# EAGLE design esquematico (EAGLE 8.1.0)
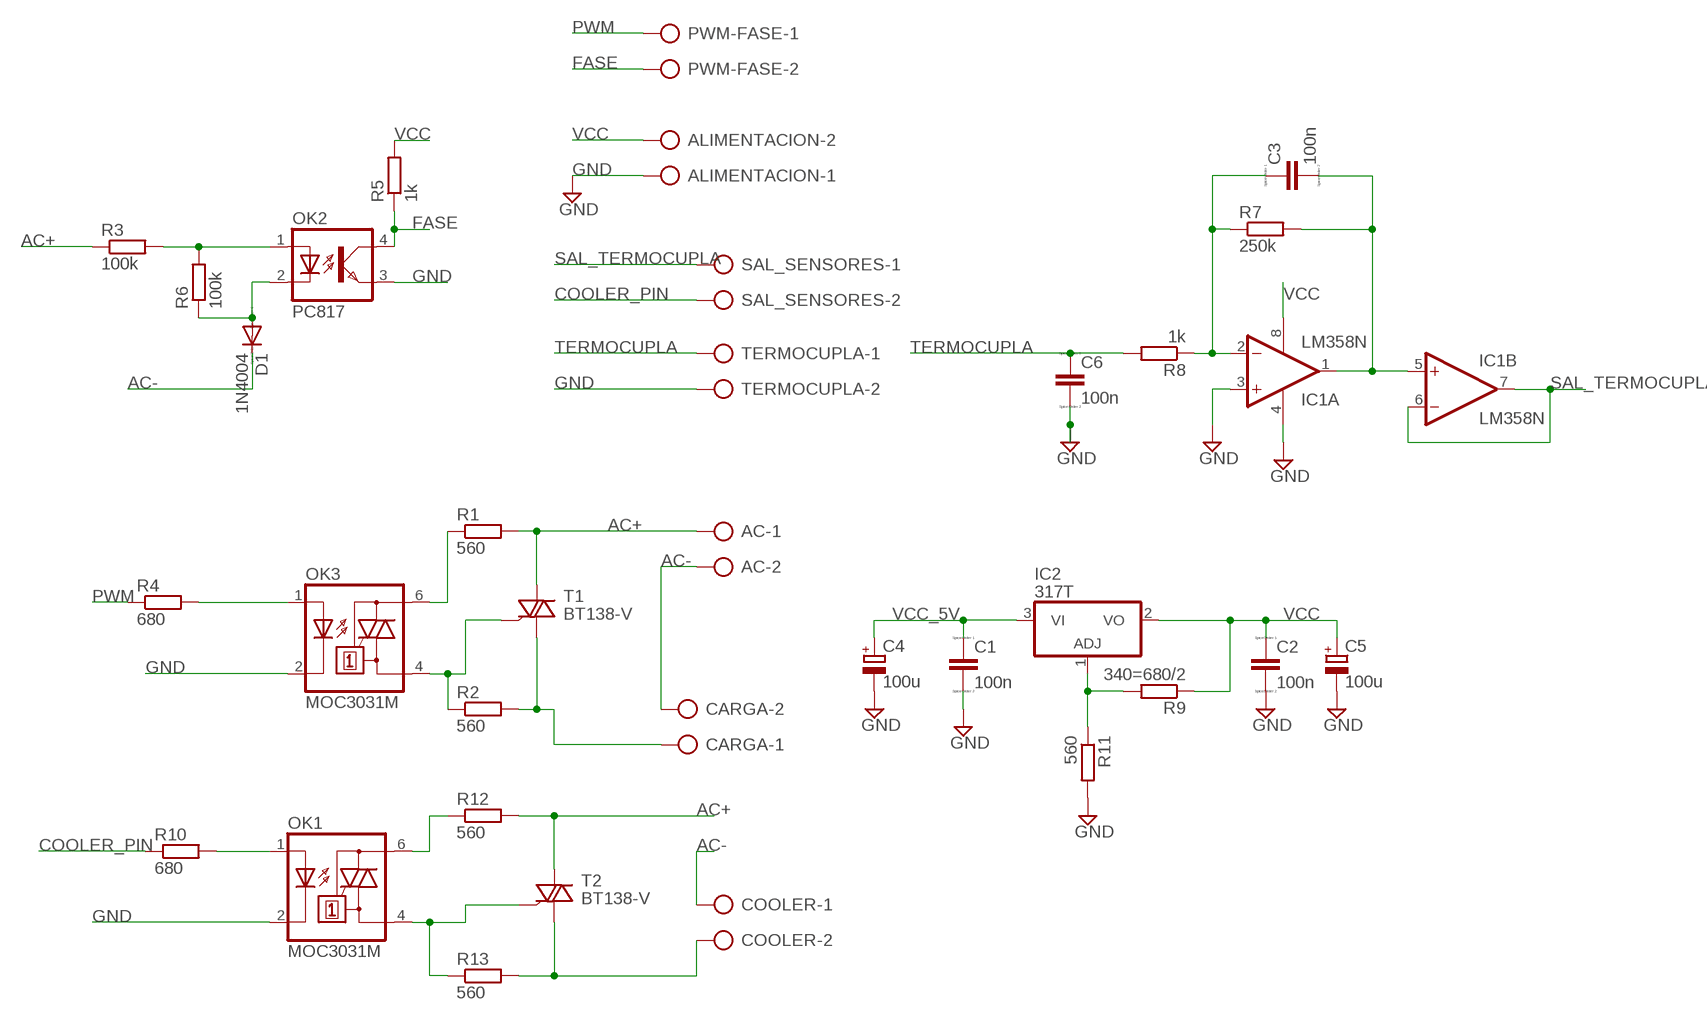
[diagram p0: schematic, sheet 1]

## Parts
AC  AK300/2  [AK300/2]
ALIMENTACION  AK300/2  [AK300/2]
C1  100n  CC1206  [C1206]
C2  100n  CC1206  [C1206]
C3  100n  CC1206  [C1206]
C4  100u  CPOL-EUE1.8-4  [E1,8-4]
C5  100u  CPOL-EUE1.8-4  [E1,8-4]
C6  100n  CC1206  [C1206]
CARGA  AK300/2  [AK300/2]
COOLER  AK300/2  [AK300/2]
D1  1N4004  [DO41-10]
IC1  LM358N  [DIL08]
IC2  317T  [TO220H]
OK1  MOC3031M  [DIL06]
OK2  PC817  [DIL04]
OK3  MOC3031M  [DIL06]
PWM-FASE  AK300/2  [AK300/2]
R1  560  R-EU_R1206  [R1206]
R2  560  R-EU_R1206  [R1206]
R3  100k  R-EU_0207/10  [0207/10]
R4  680  R-EU_R1206  [R1206]
R5  1k  R-EU_R1206  [R1206]
R6  100k  R-EU_R1206  [R1206]
R7  250k  R-EU_R1206  [R1206]
R8  1k  R-EU_R1206  [R1206]
R9  340=680/2  R-EU_R1206  [R1206]
R10  680  R-EU_R1206  [R1206]
R11  560  R-EU_R1206  [R1206]
R12  560  R-EU_R1206  [R1206]
R13  560  R-EU_R1206  [R1206]
SAL_SENSORES  AK300/2  [AK300/2]
T1  BT138-V  [TO220BV]
T2  BT138-V  [TO220BV]
TERMOCUPLA  AK300/2  [AK300/2]

## Nets
AC+: AC.1 R1.2 R3.1 R12.2 T1.T2(A2) T2.T2(A2)
AC-: AC.2 CARGA.2 COOLER.1 D1.C
COOLER_PIN: R10.1 SAL_SENSORES.2
FASE: OK2.4(COL) PWM-FASE.2 R5.1
GND: ALIMENTACION.1 C1.2 C2.2 C4.- C5.- C6.2 IC1.3(A:+IN) IC1.4(P:V-) OK1.2(C) OK2.3(EMIT) OK3.2(C) R11.2 TERMOCUPLA.2
N$1: OK3.1(A) R4.2
N$2: OK3.6(A2) R1.1
N$3: OK2.1(A) R3.2 R6.2
N$4: CARGA.1 R2.2 T1.T1(A1)
N$5: C3.1 IC1.2(A:-IN) R7.1 R8.1
N$6: IC2.1(ADJ) R9.2 R11.1
N$7: C3.2 IC1.1(A:OUT) IC1.5(B:+IN) R7.2
N$8: OK3.4(A1) R2.1 T1.G
N$9: D1.A OK2.2(C) R6.1
N$11: OK1.1(A) R10.2
N$12: OK1.6(A2) R12.1
N$15: OK1.4(A1) R13.1 T2.G
N$17: COOLER.2 R13.2 T2.T1(A1)
PWM: PWM-FASE.1 R4.1
SAL_TERMOCUPLA: IC1.6(B:-IN) IC1.7(B:OUT) SAL_SENSORES.1
TERMOCUPLA: C6.1 R8.2 TERMOCUPLA.1
VCC: ALIMENTACION.2 C2.1 C5.+ IC1.8(P:V+) IC2.2(VO) R5.2 R9.1
VCC_5V: C1.1 C4.+ IC2.3(VI)

## Library data of the parts
AC ALIMENTACION CARGA COOLER PWM-FASE SAL_SENSORES TERMOCUPLA = con-ptr500:AK300/2: CONNECTOR; OC_FARNELL: unknown; OC_NEWARK: unknown
C1-C3 C6 = eagle-ltspice:C: CAPACITOR, European symbol; SPICEMODEL: NONE; SPICEPREFIX: C
C4 C5 = rcl:CPOL-EU: POLARIZED CAPACITOR, European symbol
D1 = diode:1N4004: DIODE general purpose rectifier, 1 A
IC1 = linear:LM358: OP AMP also LM158; LM258; LM2904 Source: http://cache.national.com/ds/LM/LM158.pdf
IC2 = linear:*317: Positive VOLTAGE REGULATOR
OK1 OK3 = optocoupler:MOC30*: 6-Pin DIP Zero-Cross Optoisolators Triac Driver Output (250/400 Volt Peak) Source: Data sheet <http://www.fairchildsemi.com/ds/MO/MOC3031M.pdf> The old path of data sheet not more available 2013-05-06.; MF: FAIRCHILD SEMICONDUCTOR; MPN: MOC3031M; OC_FARNELL: 9875964; OC_NEWARK: 78K6089
OK2 = optocoupler:PC817: SHARP OPTO COUPLER; MPN: PC817X4J000F; OC_FARNELL: 9707727; OC_NEWARK: 97K7059
R1-R13 = resistor:R-EU_: RESISTOR, European symbol
T1 T2 = triac:BT138: TRIAC Source: http://www.semiconductors.philips.com BT138_SERIES_2.pdf

## Net classes
0 default: width 0.991 mm, drill 0.991 mm, clearance 0.762 mm

## Board
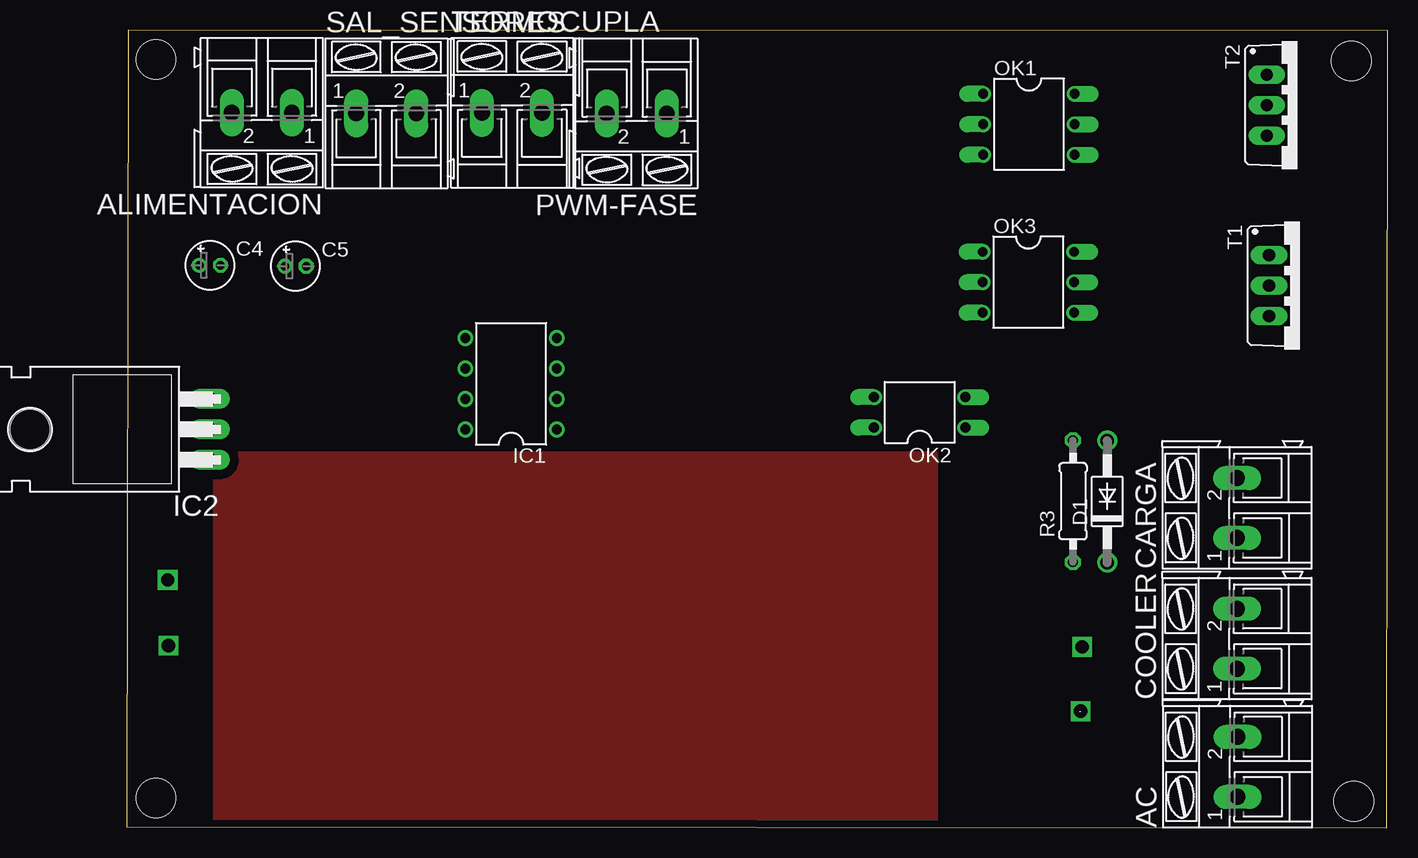
[diagram p1: board, top side]
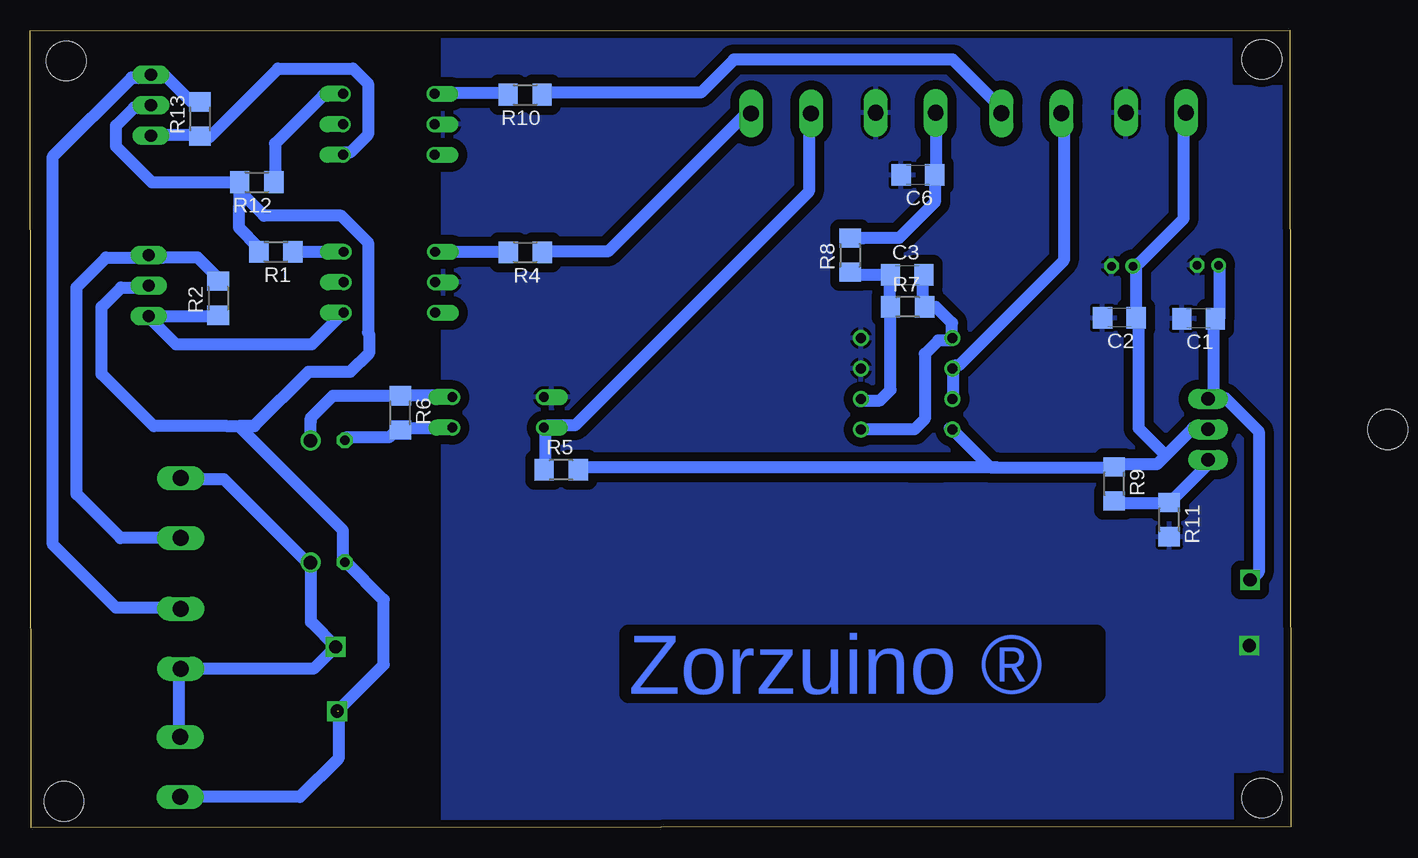
[diagram p2: board, bottom side, seen from below]

Size 105.11 x 66.51 mm. Coordinates in mm from the lower left corner, seen from the top.
Outline: 0,0.08 105.01,0 105.11,66.43 0.1,66.51 0,0.08
Copper layers (1*16): Top 0.035mm / dielectric 1.5mm / Bottom 0.035mm
Design rules "default *": minimum track width 26mil, minimum drill 50mil, track to track 20mil, track to pad 30mil, pad to pad 20mil, via to via 20mil, smd to smd 16mil, copper to edge 25mil, drill to drill 25mil, minimum pad ring 10mil, minimum via ring 8mil, stop-mask expansion 4mil, vias tented up to drill 0mil, thermal gap 10mil
Holes 3.3 mm at 2.42,2.46 2.42,64.05 102.08,63.92 102.27,2.19

### Footprints (pad centres in the part's own frame; a part is rotated, then mirrored left to right if it is on the bottom)
AK300/2 = drill 1.321 long: 1 -2.515,0; 2 2.489,0
C1206 = smd 1.6 x 1.8: 1 -1.4,0; 2 1.4,0
E1,8-4 = drill 0.711 pad 1.168: + -0.889,0 | drill 0.711 pad 1.168 octagon: - 0.889,0
DO41-10 = drill 1.118: A 5.08,0; C -5.08,0
DIL08 = drill 0.813 pad 1.27: 1 -3.81,-3.81; 2 -1.27,-3.81; 3 1.27,-3.81; 4 3.81,-3.81; 5 3.81,3.81; 6 1.27,3.81; 7 -1.27,3.81; 8 -3.81,3.81
TO220H = drill 1.118 long: 1 -2.54,-10.16; 2 0,-10.16; 3 2.54,-10.16 | hole 3.302: 0,4.826
DIL06 = drill 0.813 offset: 1 -2.54,-3.81; 2 0,-3.81; 3 2.54,-3.81; 4 2.54,3.81; 5 0,3.81; 6 -2.54,3.81
DIL04 = drill 0.813 offset: 1 -1.27,-3.81; 2 1.27,-3.81; 3 1.27,3.81; 4 -1.27,3.81
R1206 = smd 1.6 x 1.803: 1 -1.422,0; 2 1.422,0
0207/10 = drill 0.813 octagon: 1 -5.08,0; 2 5.08,0
TO220BV = drill 1.016 long: G 2.54,-2.54; T1 -2.54,-2.54; T2 0,-2.54

### Placement (x,y rotation side)
AC  92.59,5.08 90 top
ALIMENTACION  11.24,59.61 180 top
C1  7.7,42.44 180 bottom
C2  14.3,42.51 180 bottom
C3  31.98,46.08 0 bottom
C4  6.92,46.9 0 top
C5  14.06,46.82 0 top
C6  31.09,54.42 180 bottom
CARGA  92.55,26.66 90 top
COOLER  92.55,15.76 90 top
D1  81.73,27.19 90 top
IC1  32.03,37.01 90 top
IC2  -3.25,33.21 90 top
OK1  75.2,58.65 270 top
OK2  66.09,34.63 90 top
OK3  75.15,45.48 270 top
PWM-FASE  42.49,59.55 180 top
R1  84.61,48.02 180 bottom
R2  89.42,44.14 90 bottom
R3  78.87,27.22 90 top
R4  63.82,47.97 180 bottom
R5  60.83,29.83 0 bottom
R6  74.24,34.59 270 bottom
R7  31.95,43.42 0 bottom
R8  36.75,47.74 90 bottom
R9  14.73,28.66 270 bottom
R10  63.84,61.11 180 bottom
R11  10.14,25.68 270 bottom
R12  86.2,53.82 180 bottom
R13  90.93,59.08 90 bottom
SAL_SENSORES  21.64,59.56 0 top
T1  97.76,45.19 270 top
T2  97.56,60.25 270 top
TERMOCUPLA  32.12,59.6 0 top

### Tracks (layer width: path | path; a pad name or v marks a point on that pad's centre or on a via)
AC+  (via drill 1.1)  (1 unrouted)
  Bottom 0.991: 87.69,50.04 87.69,51.77 87.69,53.19 87.69,53.79 R12.2 88.19,53.79 94.94,53.79 97.94,56.79 97.94,58.54 96.44,60.04 95.19,60.04 T2.T2 | AC.1 92.44,2.79 | 78.69,22.04 R3.1 | 95.44,45.04 T1.T2 | 78.19,50.04 76.94,48.79 76.94,41.29
  Bottom 1: 79.4,9.71 79.4,5.76 82.59,2.56 AC.1 | v79.51,9.71 75.63,13.59 75.63,19.01 78.76,22.14 R3.1 | 78.19,50.04 79.17,51.02 85.59,51.02 87.69,53.12 87.69,53.19 | 95.44,45.04 97.52,45.04 99.14,43.42 99.14,37.82 94.79,33.47 88.67,33.47 87.71,33.47 | R3.1 78.84,22.17 | R3.1 79.01,22.28 79.01,24.77 87.71,33.47 | 76.94,41.29 76.86,41.21 76.86,39.55 78.41,38 81.89,38 86.42,33.47 87.71,33.47 | R1.2 86.03,48.38 87.69,50.04
AC-  (via drill 1.1)
  Bottom 0.991: AC.2 92.69,7.79 92.69,13.04 COOLER.1 92.19,13.54 | 81.69,22.04 D1.C 82.19,22.29 82.81,22.91 88.94,29.04 92.44,29.04 CARGA.2
  Bottom 1: 81.69,22.04 81.69,17.14 v79.63,15.08 81.47,13.24 COOLER.1
COOLER_PIN
  Bottom 0.991: R10.1 62.19,61.29 49.19,61.29 46.44,64.04 28.19,64.04 23.94,59.79 SAL_SENSORES.2
FASE
  Bottom 0.991: R5.1 62.19,30.04 62.19,33.29 OK2.4 61.94,33.54 59.69,33.54 40.19,53.04 40.19,59.54 PWM-FASE.2
GND  (via drill 1.1)
  other vias: 3.47,15.17
  pour Bottom: 4.93,66.43 70.67,65.93 70.67,-0.02 5.09,0.03 4.94,0.18 4.94,4.72 4.89,4.77 0.11,4.77 0.01,4.87 0.01,61.7 4.84,61.7 5.04,61.9 5.04,66.42
N$1
  Bottom 0.991: R4.2 65.44,48.04 71.19,48.04 OK3.1
N$2
  Bottom 1: R1.1 OK3.6
N$3
  Bottom 0.991: OK2.1 69.94,33.29 74.19,33.29 R6.2 74.69,33.04 75.19,32.54 78.69,32.54 R3.2
N$4
  Bottom 0.991: 93.94,47.54 95.19,47.54 T1.T1 95.69,47.54
  Bottom 1: CARGA.1 97.56,24.15 101.23,27.82 101.23,45.07 98.76,47.54 95.69,47.54 | R2.2 89.42,45.83 91.14,47.55 95.04,47.55 T1.T1
N$5
  Bottom 0.991: C3.1 33.44,46.04 33.44,43.54 R7.1 | 35.94,35.54 IC1.2
  Bottom 1: 35.95,35.63 IC1.2 35.73,35.63 34.24,35.63 33.37,36.5 R7.1 | C3.1 36.51,46.08 R8.1
N$6
  Bottom 0.991: IC2.1 6.69,30.54 9.94,27.29 R11.1 10.44,27.04 14.69,27.04 R9.2
N$7
  Bottom 0.991: C3.2 30.69,46.04 30.69,43.54 R7.2 30.44,43.04 | IC1.1 35.69,33.29
  Bottom 1: R7.2 29.59,43.42 28.25,42.08 28.25,40.85 IC1.5 28.42,40.62 29.4,40.62 30.51,39.51 30.51,34.09 31.4,33.2 IC1.1
N$8
  Bottom 0.991: 95.19,42.79 T1.G 94.94,42.29 92.94,40.28
  Bottom 1: OK3.4 81.61,40.28 92.94,40.28 | T1.G 89.42,42.65 R2.1
N$9
  Bottom 0.991: OK2.2 69.94,36.04 74.19,36.04 R6.1 74.69,36.04 | 81.69,32.29 D1.A
  Bottom 1: D1.A 81.73,33.84 81.71,33.86 81.71,34.16 79.85,36.02 R6.1
N$10
  pour Top: 7.41,0.18 7.41,31.18 67.41,31.18 67.41,0.18
N$11
  Bottom 0.991: R10.2 65.44,61.29 71.19,61.29 OK1.1
N$12
  Bottom 0.991: R12.1 84.69,54.04 84.69,57.04 80.69,61.04 79.19,61.04 OK1.6
N$15
  Bottom 0.991: T2.G 94.94,57.79 90.94,57.79 R13.1 90.44,57.54 90.19,57.54 84.44,63.29 78.19,63.29 76.94,62.04 76.94,57.79 78.44,56.29 78.94,56.29 OK1.4
N$17
  Bottom 0.991: R13.2 90.94,60.54 91.69,60.54 93.94,62.79 T2.T1 95.44,62.54 96.44,62.54
  Bottom 1: COOLER.2 92.64,18.34 97.94,18.34 103.21,23.61 103.21,55.97 96.64,62.54 96.44,62.54
PWM
  Bottom 0.991: R4.1 62.19,48.04 56.94,48.04 45.19,59.79 PWM-FASE.1
SAL_TERMOCUPLA
  Bottom 0.991: IC1.7 28.19,35.79 28.19,38.04 IC1.6 27.94,38.54 27.69,38.54 18.94,47.29 18.94,59.54 SAL_SENSORES.1
TERMOCUPLA
  Bottom 0.991: 29.69,59.54 TERMOCUPLA.1
  Bottom 1: 35.57,49.16 R8.2 32.67,49.17 29.69,52.15 C6.1 29.61,54.51 TERMOCUPLA.1
VCC
  Bottom 0.991: 31.69,30.04 59.19,30.04 R5.2 | 28.44,33.29 IC1.8 | 10.44,31.04 8.19,33.29 6.94,33.29 IC2.2 | 10.44,31.04 11.19,30.29 14.69,30.29 R9.1 15.19,30.04 24.54,30.04 29.19,30.04 | 10.44,31.04 12.69,33.29 12.69,42.04 C2.1 12.94,42.54 12.94,46.79 C5.+ 12.69,47.04 8.94,50.79 8.94,59.54 ALIMENTACION.2
  Bottom 1: 29.19,30.04 31.69,30.04 | IC1.8 25.06,30.04 24.54,30.04
VCC_5V  (via drill 1.1)
  Bottom 0.991: v3.41,20.65 3.19,20.79 2.69,21.29 2.69,33.04 5.44,35.79 6.69,35.79 IC2.3 6.44,36.04 6.44,42.29 C1.1 5.94,42.54 5.94,46.79 C4.+

### Text on the board
Bottom: Zorzuino ®